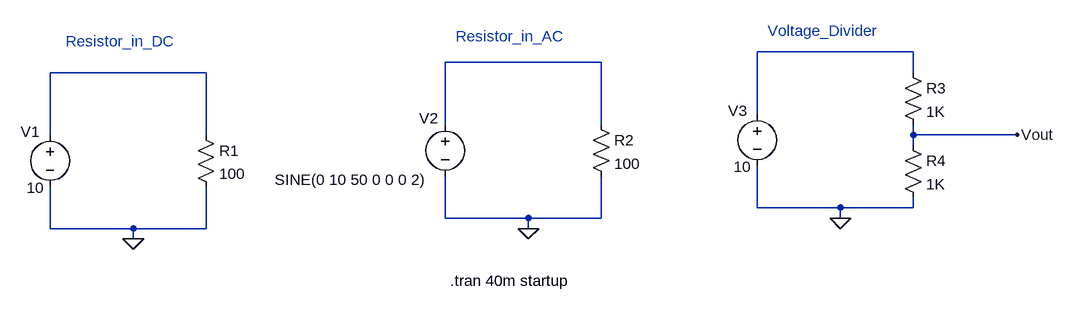
[diagram p0: schematic Resistor.asc]
Resistor.asc, the LTspice schematic file:
Version 4
SHEET 1 1304 680
WIRE 1072 16 832 16
WIRE 592 32 352 32
WIRE -16 48 -256 48
WIRE 1072 48 1072 16
WIRE 832 112 832 16
WIRE 352 128 352 32
WIRE 592 128 592 32
WIRE -256 144 -256 48
WIRE -16 144 -16 48
WIRE 1072 144 1072 128
WIRE 1232 144 1072 144
WIRE 1072 160 1072 144
WIRE 832 256 832 192
WIRE 960 256 832 256
WIRE 1072 256 1072 240
WIRE 1072 256 960 256
WIRE 352 272 352 208
WIRE 480 272 352 272
WIRE 592 272 592 208
WIRE 592 272 480 272
WIRE 960 272 960 256
WIRE -256 288 -256 224
WIRE -128 288 -256 288
WIRE -16 288 -16 224
WIRE -16 288 -128 288
WIRE 480 288 480 272
WIRE -128 304 -128 288
FLAG 480 288 0
FLAG -128 304 0
FLAG 960 272 0
FLAG 1232 144 Vout
SYMBOL res 576 112 R0
SYMATTR InstName R2
SYMATTR Value 100
SYMBOL voltage 352 112 R0
WINDOW 3 -262 101 Left 2
WINDOW 123 -76 97 Left 2
WINDOW 39 0 0 Left 0
WINDOW 0 -40 6 Left 2
SYMATTR Value SINE(0 10 50 0 0 0 2)
SYMATTR InstName V2
SYMBOL res -32 128 R0
SYMATTR InstName R1
SYMATTR Value 100
SYMBOL voltage -256 128 R0
WINDOW 0 -45 11 Left 2
WINDOW 3 -36 97 Left 2
WINDOW 123 -76 97 Left 2
WINDOW 39 0 0 Left 0
SYMATTR InstName V1
SYMATTR Value 10
SYMBOL res 1056 32 R0
SYMATTR InstName R3
SYMATTR Value 1K
SYMBOL voltage 832 96 R0
WINDOW 0 -45 11 Left 2
WINDOW 3 -36 97 Left 2
WINDOW 123 -76 97 Left 2
WINDOW 39 0 0 Left 0
SYMATTR InstName V3
SYMATTR Value 10
SYMBOL res 1056 144 R0
SYMATTR InstName R4
SYMATTR Value 1K
TEXT 360 368 Left 2 !.tran 40m startup
TEXT -232 0 Left 2 ;Resistor_in_DC
TEXT 368 -8 Left 2 ;Resistor_in_AC
TEXT 848 -16 Left 2 ;Voltage_Divider

The netlist it stands for:
* Resistor.asc
R2 N002 0 100
V2 N002 0 SINE(0 10 50 0 0 0 2)
R1 N003 0 100
V1 N003 0 10
R3 N001 Vout 1K
V3 N001 0 10
R4 Vout 0 1K
.tran 40m startup
* Resistor_in_DC
* Resistor_in_AC
* Voltage_Divider
.backanno
.end